# Altium project Ouch_Area.PrjPcb
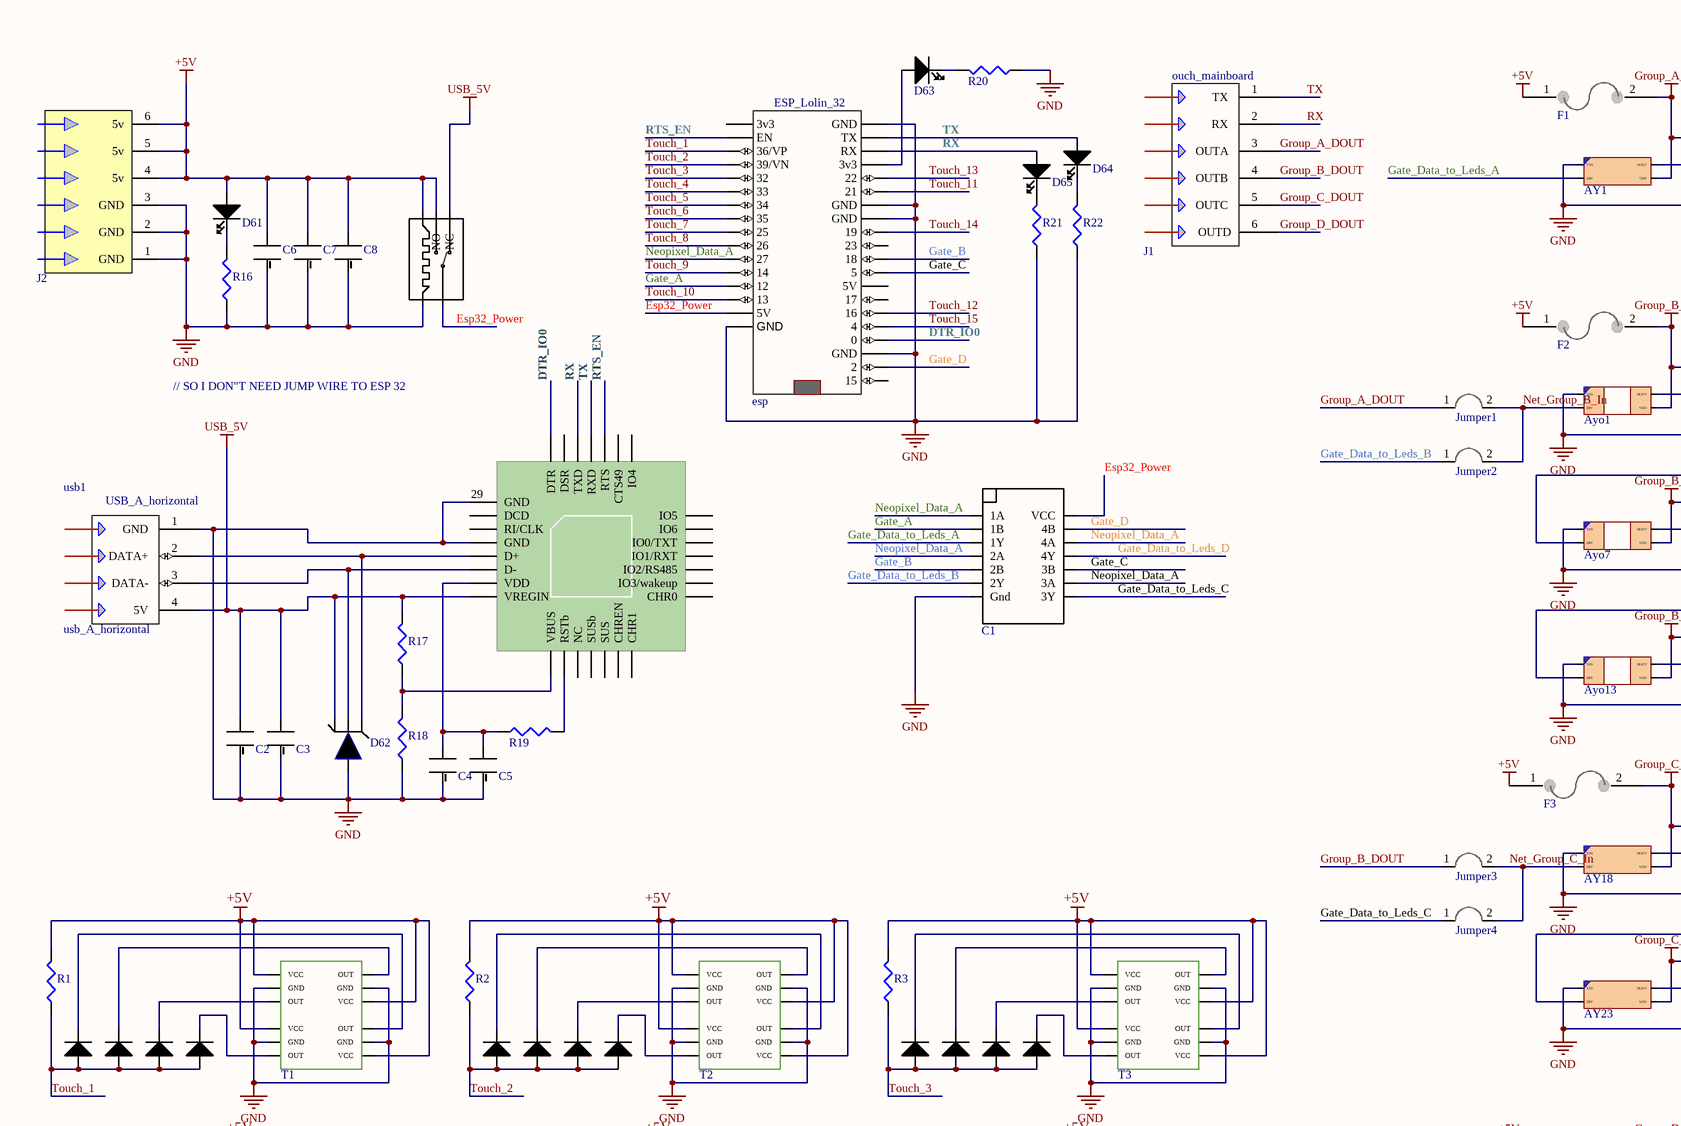
[diagram p0: ouch_area_schematic.SchDoc, top left]
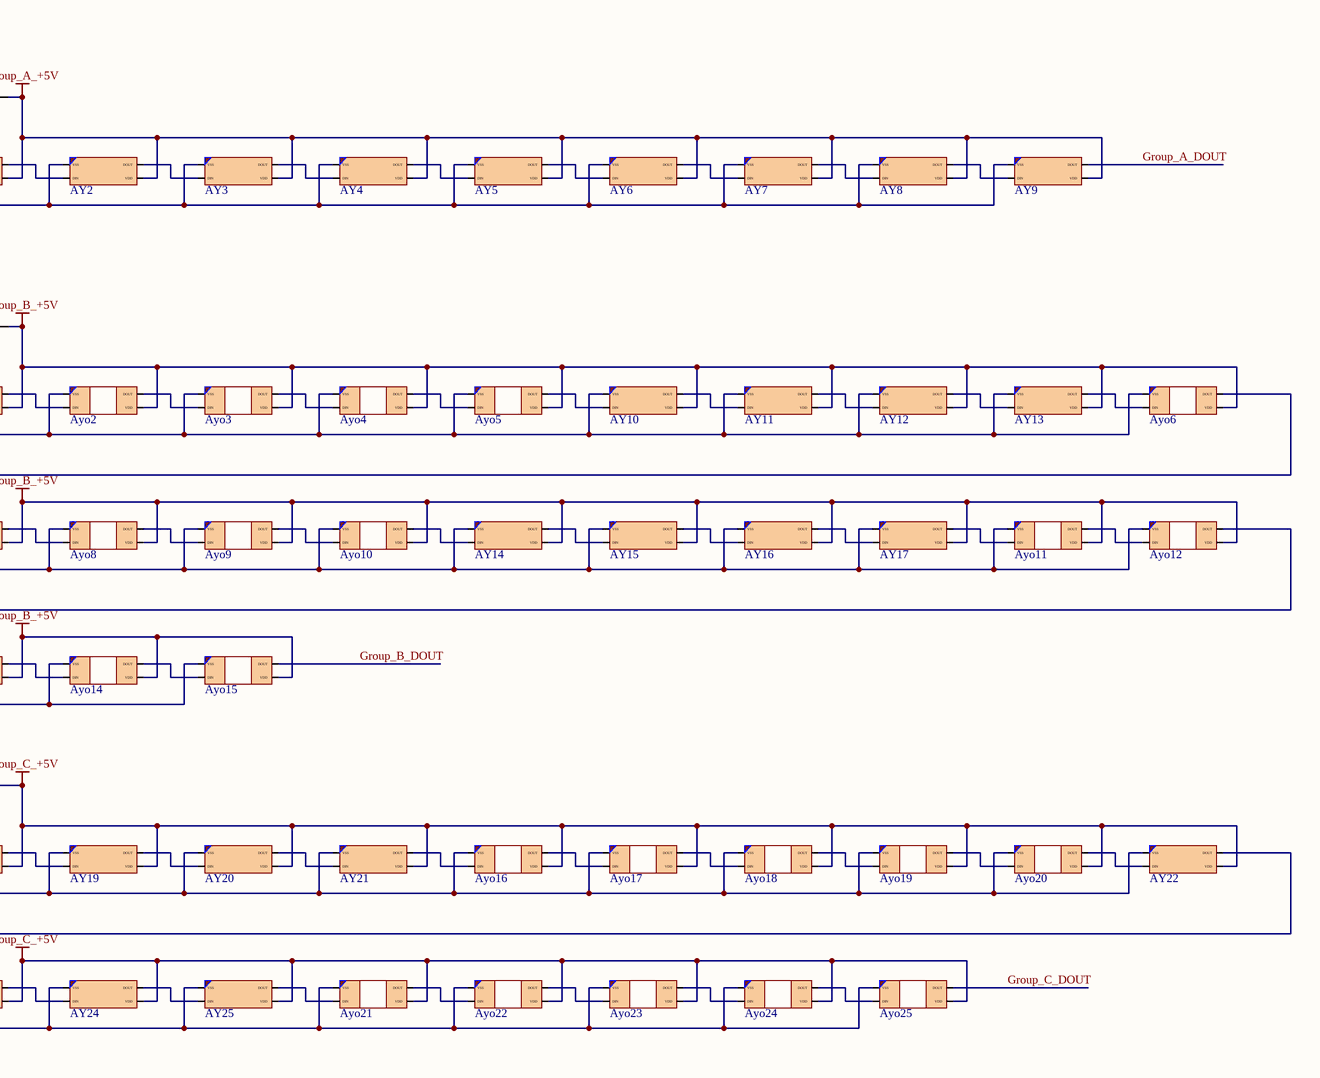
[diagram p1: ouch_area_schematic.SchDoc, top right]
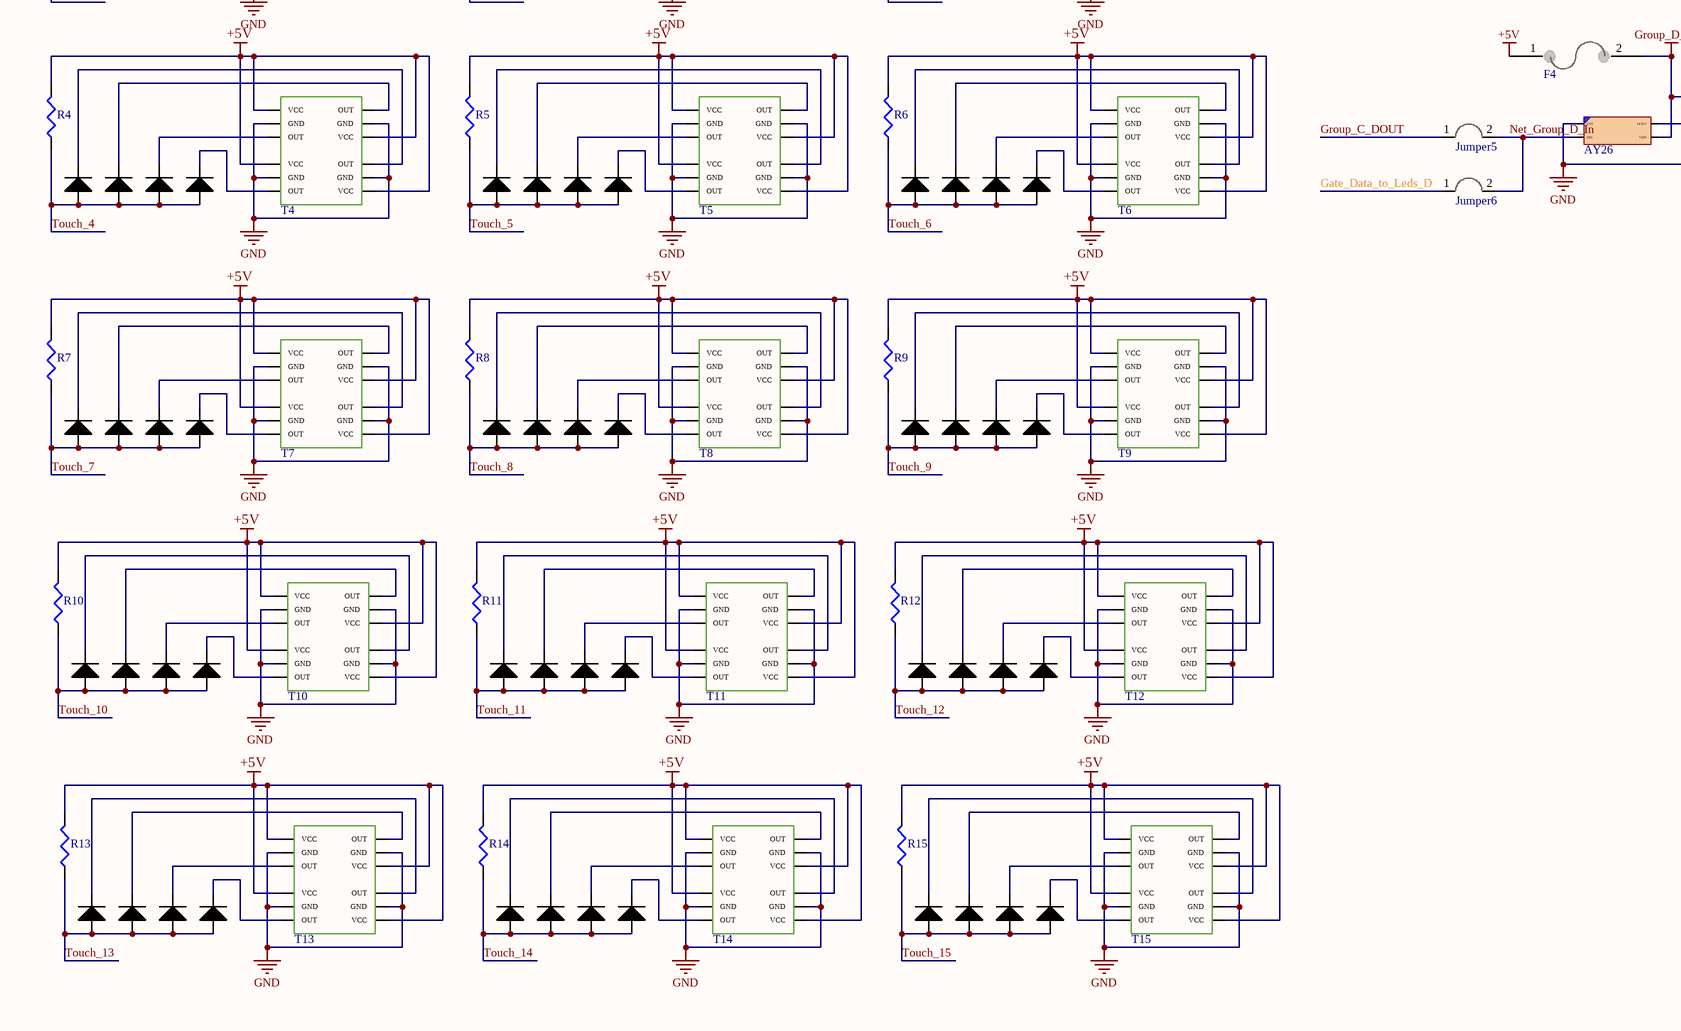
[diagram p2: ouch_area_schematic.SchDoc, bottom left]
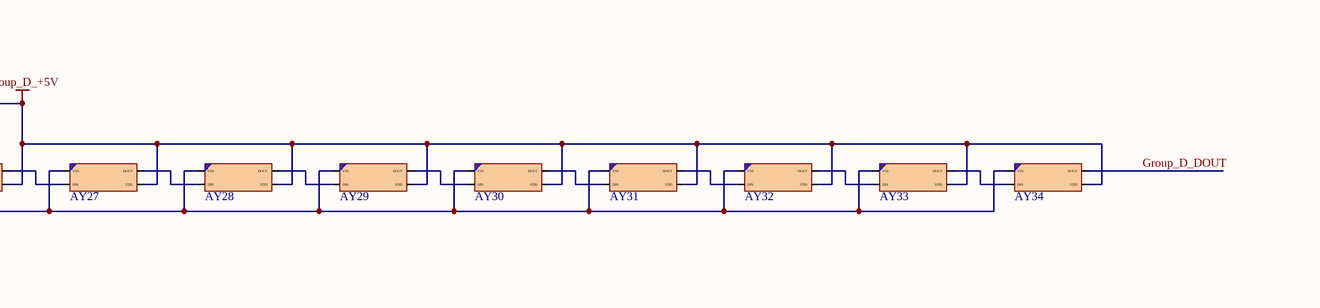
[diagram p3: ouch_area_schematic.SchDoc, bottom right]
1 sheet, 185 parts. Net scope: global (net labels, ports and power ports of the same name join across sheets).
Board file: ouch_area.PcbDoc

## Sheet ouch_area_schematic.SchDoc
size A2; Organization: Altium Limited; Address1: L3, 12a Rodborough Rd; Address2: Frenchs Forest; Address3: NSW; Address4: Australia 2086

### Parts
AY1  1  [27xWs2812B_withC]  (value not drawn)
AY2  28  [27xWs2812B_withC]  (value not drawn)
AY3  55  [27xWs2812B_withC]  (value not drawn)
AY4  82  [27xWs2812B_withC]  (value not drawn)
AY5  109  [27xWs2812B_withC]  (value not drawn)
AY6  136  [27xWs2812B_withC]  (value not drawn)
AY7  163  [27xWs2812B_withC]  (value not drawn)
AY8  190  [27xWs2812B_withC]  (value not drawn)
AY9  217  [27xWs2812B_withC]  (value not drawn)
AY10  304  [27xWs2812B_withC]  (value not drawn)
AY11  331  [27xWs2812B_withC]  (value not drawn)
AY12  358  [27xWs2812B_withC]  (value not drawn)
AY13  385  [27xWs2812B_withC]  (value not drawn)
AY14  472  [27xWs2812B_withC]  (value not drawn)
AY15  499  [27xWs2812B_withC]  (value not drawn)
AY16  526  [27xWs2812B_withC]  (value not drawn)
AY17  553  [27xWs2812B_withC]  (value not drawn)
AY18  640  [27xWs2812B_withC]  (value not drawn)
AY19  667  [27xWs2812B_withC]  (value not drawn)
AY20  694  [27xWs2812B_withC]  (value not drawn)
AY21  721  [27xWs2812B_withC]  (value not drawn)
AY22  808  [27xWs2812B_withC]  (value not drawn)
AY23  835  [27xWs2812B_withC]  (value not drawn)
AY24  862  [27xWs2812B_withC]  (value not drawn)
AY25  889  [27xWs2812B_withC]  (value not drawn)
AY26  976  [27xWs2812B_withC]  (value not drawn)
AY27  1003  [27xWs2812B_withC]  (value not drawn)
AY28  1030  [27xWs2812B_withC]  (value not drawn)
AY29  1057  [27xWs2812B_withC]  (value not drawn)
AY30  1084  [27xWs2812B_withC]  (value not drawn)
AY31  1111  [27xWs2812B_withC]  (value not drawn)
AY32  1138  [27xWs2812B_withC]  (value not drawn)
AY33  1165  [27xWs2812B_withC]  (value not drawn)
AY34  1192  [27xWs2812B_withC]  (value not drawn)
Ayo1  244  [12Xws2812b_owo]  (value not drawn)
Ayo2  256  [12Xws2812b_owo]  (value not drawn)
Ayo3  268  [12Xws2812b_owo]  (value not drawn)
Ayo4  280  [12Xws2812b_owo]  (value not drawn)
Ayo5  292  [12Xws2812b_owo]  (value not drawn)
Ayo6  412  [12Xws2812b_owo]  (value not drawn)
Ayo7  424  [12Xws2812b_owo]  (value not drawn)
Ayo8  436  [12Xws2812b_owo]  (value not drawn)
Ayo9  448  [12Xws2812b_owo]  (value not drawn)
Ayo10  460  [12Xws2812b_owo]  (value not drawn)
Ayo11  580  [12Xws2812b_owo]  (value not drawn)
Ayo12  592  [12Xws2812b_owo]  (value not drawn)
Ayo13  604  [12Xws2812b_owo]  (value not drawn)
Ayo14  616  [12Xws2812b_owo]  (value not drawn)
Ayo15  628  [12Xws2812b_owo]  (value not drawn)
Ayo16  748  [12Xws2812b_owo]  (value not drawn)
Ayo17  760  [12Xws2812b_owo]  (value not drawn)
Ayo18  772  [12Xws2812b_owo]  (value not drawn)
Ayo19  784  [12Xws2812b_owo]  (value not drawn)
Ayo20  796  [12Xws2812b_owo]  (value not drawn)
Ayo21  916  [12Xws2812b_owo]  (value not drawn)
Ayo22  928  [12Xws2812b_owo]  (value not drawn)
Ayo23  940  [12Xws2812b_owo]  (value not drawn)
Ayo24  952  [12Xws2812b_owo]  (value not drawn)
Ayo25  964  [12Xws2812b_owo]  (value not drawn)
C1  74hc08d  [SOP14(74hc08d)]  (value not drawn)
C2  C4R7  [Capacitor0603]  (value not drawn)
C3  C104  [Capacitor0603]  (value not drawn)
C4  C104  [Capacitor0603]  (value not drawn)
C5  C4R7  [Capacitor0603]  (value not drawn)
C6  EEU-FM0J331  [2.5mmCapacitor]  (value not drawn)
C7  EEU-FM0J331  [2.5mmCapacitor]  (value not drawn)
C8  EEU-FM0J331  [2.5mmCapacitor]  (value not drawn)
cp1  CP2102N  [CP2102N_QFN28]  (value not drawn)
D1  LL4148  [SOD80-LL4148]  (value not drawn)
D2  LL4148  [SOD80-LL4148]  (value not drawn)
D3  LL4148  [SOD80-LL4148]  (value not drawn)
D4  LL4148  [SOD80-LL4148]  (value not drawn)
D5  LL4148  [SOD80-LL4148]  (value not drawn)
D6  LL4148  [SOD80-LL4148]  (value not drawn)
D7  LL4148  [SOD80-LL4148]  (value not drawn)
D8  LL4148  [SOD80-LL4148]  (value not drawn)
D9  LL4148  [SOD80-LL4148]  (value not drawn)
D10  LL4148  [SOD80-LL4148]  (value not drawn)
D11  LL4148  [SOD80-LL4148]  (value not drawn)
D12  LL4148  [SOD80-LL4148]  (value not drawn)
D13  LL4148  [SOD80-LL4148]  (value not drawn)
D14  LL4148  [SOD80-LL4148]  (value not drawn)
D15  LL4148  [SOD80-LL4148]  (value not drawn)
D16  LL4148  [SOD80-LL4148]  (value not drawn)
D17  LL4148  [SOD80-LL4148]  (value not drawn)
D18  LL4148  [SOD80-LL4148]  (value not drawn)
D19  LL4148  [SOD80-LL4148]  (value not drawn)
D20  LL4148  [SOD80-LL4148]  (value not drawn)
D21  LL4148  [SOD80-LL4148]  (value not drawn)
D22  LL4148  [SOD80-LL4148]  (value not drawn)
D23  LL4148  [SOD80-LL4148]  (value not drawn)
D24  LL4148  [SOD80-LL4148]  (value not drawn)
D25  LL4148  [SOD80-LL4148]  (value not drawn)
D26  LL4148  [SOD80-LL4148]  (value not drawn)
D27  LL4148  [SOD80-LL4148]  (value not drawn)
D28  LL4148  [SOD80-LL4148]  (value not drawn)
D29  LL4148  [SOD80-LL4148]  (value not drawn)
D30  LL4148  [SOD80-LL4148]  (value not drawn)
D31  LL4148  [SOD80-LL4148]  (value not drawn)
D32  LL4148  [SOD80-LL4148]  (value not drawn)
D33  LL4148  [SOD80-LL4148]  (value not drawn)
D34  LL4148  [SOD80-LL4148]  (value not drawn)
D35  LL4148  [SOD80-LL4148]  (value not drawn)
D36  LL4148  [SOD80-LL4148]  (value not drawn)
D37  LL4148  [SOD80-LL4148]  (value not drawn)
D38  LL4148  [SOD80-LL4148]  (value not drawn)
D39  LL4148  [SOD80-LL4148]  (value not drawn)
D40  LL4148  [SOD80-LL4148]  (value not drawn)
D41  LL4148  [SOD80-LL4148]  (value not drawn)
D42  LL4148  [SOD80-LL4148]  (value not drawn)
D43  LL4148  [SOD80-LL4148]  (value not drawn)
D44  LL4148  [SOD80-LL4148]  (value not drawn)
D45  LL4148  [SOD80-LL4148]  (value not drawn)
D46  LL4148  [SOD80-LL4148]  (value not drawn)
D47  LL4148  [SOD80-LL4148]  (value not drawn)
D48  LL4148  [SOD80-LL4148]  (value not drawn)
D49  LL4148  [SOD80-LL4148]  (value not drawn)
D50  LL4148  [SOD80-LL4148]  (value not drawn)
D51  LL4148  [SOD80-LL4148]  (value not drawn)
D52  LL4148  [SOD80-LL4148]  (value not drawn)
D53  LL4148  [SOD80-LL4148]  (value not drawn)
D54  LL4148  [SOD80-LL4148]  (value not drawn)
D55  LL4148  [SOD80-LL4148]  (value not drawn)
D56  LL4148  [SOD80-LL4148]  (value not drawn)
D57  LL4148  [SOD80-LL4148]  (value not drawn)
D58  LL4148  [SOD80-LL4148]  (value not drawn)
D59  LL4148  [SOD80-LL4148]  (value not drawn)
D60  LL4148  [SOD80-LL4148]  (value not drawn)
D61  P_on  [LED0603]  (value not drawn)
D62  SP0503BAHTG  [SP0503BAHTG - SOT143-4]  (value not drawn)
D63  ESP  [LED0603]  (value not drawn)
D64  TXD  [LED0603]  (value not drawn)
D65  RXD  [LED0603]  (value not drawn)
esp  processor  [ESP_32_socket]  (value not drawn)
F1  PTC_0ZCG0260FF2C  [SMD_1812]  (value not drawn)
F2  PTC_0ZCG0260FF2C  [SMD_1812]  (value not drawn)
F3  PTC_0ZCG0260FF2C  [SMD_1812]  (value not drawn)
F4  PTC_0ZCG0260FF2C  [SMD_1812]  (value not drawn)
J1  ouch_and_mainboard_connector  [xh2.54 6pin]  (value not drawn)
J2  4.2mm_5v_gnd_3x3  [4.2MM_6pin_all_5]  (value not drawn)
Jumper1  FromA  [0805Jumper]  (value not drawn)
Jumper2  NewB  [0805Jumper]  (value not drawn)
Jumper3  FromB  [0805Jumper]  (value not drawn)
Jumper4  NewC  [0805Jumper]  (value not drawn)
Jumper5  FromC  [0805Jumper]  (value not drawn)
Jumper6  NewD  [0805Jumper]  (value not drawn)
R1  R102  [R0805]  (value not drawn)
R2  R102  [R0805]  (value not drawn)
R3  R102  [R0805]  (value not drawn)
R4  R102  [R0805]  (value not drawn)
R5  R102  [R0805]  (value not drawn)
R6  R102  [R0805]  (value not drawn)
R7  R102  [R0805]  (value not drawn)
R8  R102  [R0805]  (value not drawn)
R9  R102  [R0805]  (value not drawn)
R10  R102  [R0805]  (value not drawn)
R11  R102  [R0805]  (value not drawn)
R12  R102  [R0805]  (value not drawn)
R13  R102  [R0805]  (value not drawn)
R14  R102  [R0805]  (value not drawn)
R15  R102  [R0805]  (value not drawn)
R16  R360  [R0805]  (value not drawn)
R17  R2212  [R0805]  (value not drawn)
R18  R4752  [R0805]  (value not drawn)
R19  R102  [R0805]  (value not drawn)
R20  360R  [R0805]  (value not drawn)
R21  R360  [R0805]  (value not drawn)
R22  R360  [R0805]  (value not drawn)
Relay1  Omron_G5v_dc5  [G5v1_5vdc]  (value not drawn)
T1  Touch_pads2x2  [TouchBoard2x2]  (value not drawn)
T2  Touch_pads2x2  [TouchBoard2x2]  (value not drawn)
T3  Touch_pads2x2  [TouchBoard2x2]  (value not drawn)
T4  Touch_pads2x2  [TouchBoard2x2]  (value not drawn)
T5  Touch_pads2x2  [TouchBoard2x2]  (value not drawn)
T6  Touch_pads2x2  [TouchBoard2x2]  (value not drawn)
T7  Touch_pads2x2  [TouchBoard2x2]  (value not drawn)
T8  Touch_pads2x2  [TouchBoard2x2]  (value not drawn)
T9  Touch_pads2x2  [TouchBoard2x2]  (value not drawn)
T10  Touch_pads2x2  [TouchBoard2x2]  (value not drawn)
T11  Touch_pads2x2  [TouchBoard2x2]  (value not drawn)
T12  Touch_pads2x2  [TouchBoard2x2]  (value not drawn)
T13  Touch_pads2x2  [TouchBoard2x2]  (value not drawn)
T14  Touch_pads2x2  [TouchBoard2x2]  (value not drawn)
T15  Touch_pads2x2  [TouchBoard2x2]  (value not drawn)
usb1  usb_A_horizontal  [USBA_male_socket]

### Nets
+5V: C6.2(+) C7.2(+) C8.2(+) D61.2 F1.1 F2.1 F3.1 F4.1 J2.4(5v) J2.5(5v) J2.6(5v) R1.2 R2.2 R3.2 R4.2 R5.2 R6.2 R7.2 R8.2 R9.2 R10.2 R11.2 R12.2 R13.2 R14.2 R15.2 Relay1.1(Coli_A) Relay1.5(NO) T1.1(VCC) T1.4(VCC) T1.7(VCC) T1.10(VCC) T2.1(VCC) T2.4(VCC) T2.7(VCC) T2.10(VCC) T3.1(VCC) T3.4(VCC) T3.7(VCC) T3.10(VCC) T4.1(VCC) T4.4(VCC) T4.7(VCC) T4.10(VCC) T5.1(VCC) T5.4(VCC) T5.7(VCC) T5.10(VCC) T6.1(VCC) T6.4(VCC) T6.7(VCC) T6.10(VCC) T7.1(VCC) T7.4(VCC) T7.7(VCC) T7.10(VCC) T8.1(VCC) T8.4(VCC) T8.7(VCC) T8.10(VCC) T9.1(VCC) T9.4(VCC) T9.7(VCC) T9.10(VCC) T10.1(VCC) T10.4(VCC) T10.7(VCC) T10.10(VCC) T11.1(VCC) T11.4(VCC) T11.7(VCC) T11.10(VCC) T12.1(VCC) T12.4(VCC) T12.7(VCC) T12.10(VCC) T13.1(VCC) T13.4(VCC) T13.7(VCC) T13.10(VCC) T14.1(VCC) T14.4(VCC) T14.7(VCC) T14.10(VCC) T15.1(VCC) T15.4(VCC) T15.7(VCC) T15.10(VCC)
GND: AY1.3(VSS) AY2.3(VSS) AY3.3(VSS) AY4.3(VSS) AY5.3(VSS) AY6.3(VSS) AY7.3(VSS) AY8.3(VSS) AY9.3(VSS) AY10.3(VSS) AY11.3(VSS) AY12.3(VSS) AY13.3(VSS) AY14.3(VSS) AY15.3(VSS) AY16.3(VSS) AY17.3(VSS) AY18.3(VSS) AY19.3(VSS) AY20.3(VSS) AY21.3(VSS) AY22.3(VSS) AY23.3(VSS) AY24.3(VSS) AY25.3(VSS) AY26.3(VSS) AY27.3(VSS) AY28.3(VSS) AY29.3(VSS) AY30.3(VSS) AY31.3(VSS) AY32.3(VSS) AY33.3(VSS) AY34.3(VSS) Ayo1.3(VSS) Ayo2.3(VSS) Ayo3.3(VSS) Ayo4.3(VSS) Ayo5.3(VSS) Ayo6.3(VSS) Ayo7.3(VSS) Ayo8.3(VSS) Ayo9.3(VSS) Ayo10.3(VSS) Ayo11.3(VSS) Ayo12.3(VSS) Ayo13.3(VSS) Ayo14.3(VSS) Ayo15.3(VSS) Ayo16.3(VSS) Ayo17.3(VSS) Ayo18.3(VSS) Ayo19.3(VSS) Ayo20.3(VSS) Ayo21.3(VSS) Ayo22.3(VSS) Ayo23.3(VSS) Ayo24.3(VSS) Ayo25.3(VSS) C1.7(Gnd) C2.1(-) C3.1(-) C4.1(-) C5.1(-) C6.1(-) C7.1(-) C8.1(-) cp1.3(GND) cp1.29(GND) D62.1(+) esp.1(GND) esp.7(GND) esp.8(GND) esp.18(GND) esp.36(GND) J2.1(GND) J2.2(GND) J2.3(GND) R16.1 R18.1 R20.1 R21.1 R22.1 Relay1.2(Coli_B) T1.2(GND) T1.5(GND) T1.8(GND) T1.11(GND) T2.2(GND) T2.5(GND) T2.8(GND) T2.11(GND) T3.2(GND) T3.5(GND) T3.8(GND) T3.11(GND) T4.2(GND) T4.5(GND) T4.8(GND) T4.11(GND) T5.2(GND) T5.5(GND) T5.8(GND) T5.11(GND) T6.2(GND) T6.5(GND) T6.8(GND) T6.11(GND) T7.2(GND) T7.5(GND) T7.8(GND) T7.11(GND) T8.2(GND) T8.5(GND) T8.8(GND) T8.11(GND) T9.2(GND) T9.5(GND) T9.8(GND) T9.11(GND) T10.2(GND) T10.5(GND) T10.8(GND) T10.11(GND) T11.2(GND) T11.5(GND) T11.8(GND) T11.11(GND) T12.2(GND) T12.5(GND) T12.8(GND) T12.11(GND) T13.2(GND) T13.5(GND) T13.8(GND) T13.11(GND) T14.2(GND) T14.5(GND) T14.8(GND) T14.11(GND) T15.2(GND) T15.5(GND) T15.8(GND) T15.11(GND) usb1.1(GND)
Group_A_+5V: AY1.1(VDD) AY2.1(VDD) AY3.1(VDD) AY4.1(VDD) AY5.1(VDD) AY6.1(VDD) AY7.1(VDD) AY8.1(VDD) AY9.1(VDD) F1.2
Group_B_+5V: AY10.1(VDD) AY11.1(VDD) AY12.1(VDD) AY13.1(VDD) AY14.1(VDD) AY15.1(VDD) AY16.1(VDD) AY17.1(VDD) Ayo1.1(VDD) Ayo2.1(VDD) Ayo3.1(VDD) Ayo4.1(VDD) Ayo5.1(VDD) Ayo6.1(VDD) Ayo7.1(VDD) Ayo8.1(VDD) Ayo9.1(VDD) Ayo10.1(VDD) Ayo11.1(VDD) Ayo12.1(VDD) Ayo13.1(VDD) Ayo14.1(VDD) Ayo15.1(VDD) F2.2
Group_C_+5V: AY18.1(VDD) AY19.1(VDD) AY20.1(VDD) AY21.1(VDD) AY22.1(VDD) AY23.1(VDD) AY24.1(VDD) AY25.1(VDD) Ayo16.1(VDD) Ayo17.1(VDD) Ayo18.1(VDD) Ayo19.1(VDD) Ayo20.1(VDD) Ayo21.1(VDD) Ayo22.1(VDD) Ayo23.1(VDD) Ayo24.1(VDD) Ayo25.1(VDD) F3.2
Group_D_+5V: AY26.1(VDD) AY27.1(VDD) AY28.1(VDD) AY29.1(VDD) AY30.1(VDD) AY31.1(VDD) AY32.1(VDD) AY33.1(VDD) AY34.1(VDD) F4.2
USB_5V: C2.2(+) C3.2(+) cp1.7(VREGIN) D62.4 R17.2 Relay1.4(NC) usb1.4(5V)
DTR_IO0: cp1.28(DTR) esp.17(0)
Esp32_Power: C1.14(VCC) esp.35(5V) Relay1.3(COM)
Gate_A: C1.2(1B) esp.33(12)
Gate_B: C1.5(2B) esp.11(18)
Gate_C: C1.10(3B) esp.12(5)
Gate_D: C1.13(4B) esp.19(2)
Gate_Data_to_Leds_A: AY1.4(DIN) C1.3(1Y)
Gate_Data_to_Leds_B: C1.6(2Y) Jumper2.1
Gate_Data_to_Leds_C: C1.8(3Y) Jumper4.1
Gate_Data_to_Leds_D: C1.11(4Y) Jumper6.1
Group_A_DOUT: AY9.2(DOUT) J1.3(OUTA) Jumper1.1
Group_B_DOUT: Ayo15.2(DOUT) J1.4(OUTB) Jumper3.1
Group_C_DOUT: Ayo25.2(DOUT) J1.5(OUTC) Jumper5.1
Group_D_DOUT: AY34.2(DOUT) J1.6(OUTD)
Neopixel_Data_A: C1.1(1A) C1.4(2A) C1.9(3A) C1.12(4A) esp.31(27)
Net_Group_B_In: Ayo1.4(DIN) Jumper1.2 Jumper2.2
Net_Group_C_In: AY18.4(DIN) Jumper3.2 Jumper4.2
Net_Group_D_In: AY26.4(DIN) Jumper5.2 Jumper6.2
RTS_EN: cp1.24(RTS) esp.22(EN)
RX: cp1.26(TXD) D65.2 esp.3(RX) J1.2(RX)
Touch_1: D1.2 D2.2 D3.2 D4.2 esp.23(36/VP) R1.1
Touch_2: D5.2 D6.2 D7.2 D8.2 esp.24(39/VN) R2.1
Touch_3: D9.2 D10.2 D11.2 D12.2 esp.25(32) R3.1
Touch_4: D13.2 D14.2 D15.2 D16.2 esp.26(33) R4.1
Touch_5: D17.2 D18.2 D19.2 D20.2 esp.27(34) R5.1
Touch_6: D21.2 D22.2 D23.2 D24.2 esp.28(35) R6.1
Touch_7: D25.2 D26.2 D27.2 D28.2 esp.29(25) R7.1
Touch_8: D29.2 D30.2 D31.2 D32.2 esp.30(26) R8.1
Touch_9: D33.2 D34.2 D35.2 D36.2 esp.32(14) R9.1
Touch_10: D37.2 D38.2 D39.2 D40.2 esp.34(13) R10.1
Touch_11: D41.2 D42.2 D43.2 D44.2 esp.6(21) R11.1
Touch_12: D45.2 D46.2 D47.2 D48.2 esp.15(16) R12.1
Touch_13: D49.2 D50.2 D51.2 D52.2 esp.5(22) R13.1
Touch_14: D53.2 D54.2 D55.2 D56.2 esp.9(19) R14.1
Touch_15: D57.2 D58.2 D59.2 D60.2 esp.16(4) R15.1
TX: cp1.25(RXD) D64.2 esp.2(TX) J1.1(TX)
NetAY1_2: AY1.2(DOUT) AY2.4(DIN)
NetAY2_2: AY2.2(DOUT) AY3.4(DIN)
NetAY3_2: AY3.2(DOUT) AY4.4(DIN)
NetAY4_2: AY4.2(DOUT) AY5.4(DIN)
NetAY5_2: AY5.2(DOUT) AY6.4(DIN)
NetAY6_2: AY6.2(DOUT) AY7.4(DIN)
NetAY7_2: AY7.2(DOUT) AY8.4(DIN)
NetAY8_2: AY8.2(DOUT) AY9.4(DIN)
NetAY10_2: AY10.2(DOUT) AY11.4(DIN)
NetAY10_4: AY10.4(DIN) Ayo5.2(DOUT)
NetAY11_2: AY11.2(DOUT) AY12.4(DIN)
NetAY12_2: AY12.2(DOUT) AY13.4(DIN)
NetAY13_2: AY13.2(DOUT) Ayo6.4(DIN)
NetAY14_2: AY14.2(DOUT) AY15.4(DIN)
NetAY14_4: AY14.4(DIN) Ayo10.2(DOUT)
NetAY15_2: AY15.2(DOUT) AY16.4(DIN)
NetAY16_2: AY16.2(DOUT) AY17.4(DIN)
NetAY17_2: AY17.2(DOUT) Ayo11.4(DIN)
NetAY18_2: AY18.2(DOUT) AY19.4(DIN)
NetAY19_2: AY19.2(DOUT) AY20.4(DIN)
NetAY20_2: AY20.2(DOUT) AY21.4(DIN)
NetAY21_2: AY21.2(DOUT) Ayo16.4(DIN)
NetAY22_2: AY22.2(DOUT) AY23.4(DIN)
NetAY22_4: AY22.4(DIN) Ayo20.2(DOUT)
NetAY23_2: AY23.2(DOUT) AY24.4(DIN)
NetAY24_2: AY24.2(DOUT) AY25.4(DIN)
NetAY25_2: AY25.2(DOUT) Ayo21.4(DIN)
NetAY26_2: AY26.2(DOUT) AY27.4(DIN)
NetAY27_2: AY27.2(DOUT) AY28.4(DIN)
NetAY28_2: AY28.2(DOUT) AY29.4(DIN)
NetAY29_2: AY29.2(DOUT) AY30.4(DIN)
NetAY30_2: AY30.2(DOUT) AY31.4(DIN)
NetAY31_2: AY31.2(DOUT) AY32.4(DIN)
NetAY32_2: AY32.2(DOUT) AY33.4(DIN)
NetAY33_2: AY33.2(DOUT) AY34.4(DIN)
NetAyo1_2: Ayo1.2(DOUT) Ayo2.4(DIN)
NetAyo2_2: Ayo2.2(DOUT) Ayo3.4(DIN)
NetAyo3_2: Ayo3.2(DOUT) Ayo4.4(DIN)
NetAyo4_2: Ayo4.2(DOUT) Ayo5.4(DIN)
NetAyo6_2: Ayo6.2(DOUT) Ayo7.4(DIN)
NetAyo7_2: Ayo7.2(DOUT) Ayo8.4(DIN)
NetAyo8_2: Ayo8.2(DOUT) Ayo9.4(DIN)
NetAyo9_2: Ayo9.2(DOUT) Ayo10.4(DIN)
NetAyo11_2: Ayo11.2(DOUT) Ayo12.4(DIN)
NetAyo12_2: Ayo12.2(DOUT) Ayo13.4(DIN)
NetAyo13_2: Ayo13.2(DOUT) Ayo14.4(DIN)
NetAyo14_2: Ayo14.2(DOUT) Ayo15.4(DIN)
NetAyo16_2: Ayo16.2(DOUT) Ayo17.4(DIN)
NetAyo17_2: Ayo17.2(DOUT) Ayo18.4(DIN)
NetAyo18_2: Ayo18.2(DOUT) Ayo19.4(DIN)
NetAyo19_2: Ayo19.2(DOUT) Ayo20.4(DIN)
NetAyo21_2: Ayo21.2(DOUT) Ayo22.4(DIN)
NetAyo22_2: Ayo22.2(DOUT) Ayo23.4(DIN)
NetAyo23_2: Ayo23.2(DOUT) Ayo24.4(DIN)
NetAyo24_2: Ayo24.2(DOUT) Ayo25.4(DIN)
NetC4_2: C4.2(+) C5.2(+) cp1.6(VDD) R19.1
Netcp1_4: cp1.4(D+) D62.2 usb1.2(DATA+)
Netcp1_5: cp1.5(D-) D62.3 usb1.3(DATA-)
Netcp1_8: cp1.8(VBUS) R17.1 R18.2
Netcp1_9: cp1.9(RSTb) R19.2
NetD1_1: D1.1 T1.9(OUT)
NetD2_1: D2.1 T1.12(OUT)
NetD3_1: D3.1 T1.3(OUT)
NetD4_1: D4.1 T1.6(OUT)
NetD5_1: D5.1 T2.9(OUT)
NetD6_1: D6.1 T2.12(OUT)
NetD7_1: D7.1 T2.3(OUT)
NetD8_1: D8.1 T2.6(OUT)
NetD9_1: D9.1 T3.9(OUT)
NetD10_1: D10.1 T3.12(OUT)
NetD11_1: D11.1 T3.3(OUT)
NetD12_1: D12.1 T3.6(OUT)
NetD13_1: D13.1 T4.9(OUT)
NetD14_1: D14.1 T4.12(OUT)
NetD15_1: D15.1 T4.3(OUT)
NetD16_1: D16.1 T4.6(OUT)
NetD17_1: D17.1 T5.9(OUT)
NetD18_1: D18.1 T5.12(OUT)
NetD19_1: D19.1 T5.3(OUT)
NetD20_1: D20.1 T5.6(OUT)
NetD21_1: D21.1 T6.9(OUT)
NetD22_1: D22.1 T6.12(OUT)
NetD23_1: D23.1 T6.3(OUT)
NetD24_1: D24.1 T6.6(OUT)
NetD25_1: D25.1 T7.9(OUT)
NetD26_1: D26.1 T7.12(OUT)
NetD27_1: D27.1 T7.3(OUT)
NetD28_1: D28.1 T7.6(OUT)
NetD29_1: D29.1 T8.9(OUT)
NetD30_1: D30.1 T8.12(OUT)
NetD31_1: D31.1 T8.3(OUT)
NetD32_1: D32.1 T8.6(OUT)
NetD33_1: D33.1 T9.9(OUT)
NetD34_1: D34.1 T9.12(OUT)
NetD35_1: D35.1 T9.3(OUT)
NetD36_1: D36.1 T9.6(OUT)
NetD37_1: D37.1 T10.9(OUT)
NetD38_1: D38.1 T10.12(OUT)
NetD39_1: D39.1 T10.3(OUT)
NetD40_1: D40.1 T10.6(OUT)
NetD41_1: D41.1 T11.9(OUT)
NetD42_1: D42.1 T11.12(OUT)
NetD43_1: D43.1 T11.3(OUT)
NetD44_1: D44.1 T11.6(OUT)
NetD45_1: D45.1 T12.9(OUT)
NetD46_1: D46.1 T12.12(OUT)
NetD47_1: D47.1 T12.3(OUT)
NetD48_1: D48.1 T12.6(OUT)
NetD49_1: D49.1 T13.9(OUT)
NetD50_1: D50.1 T13.12(OUT)
NetD51_1: D51.1 T13.3(OUT)
NetD52_1: D52.1 T13.6(OUT)
NetD53_1: D53.1 T14.9(OUT)
NetD54_1: D54.1 T14.12(OUT)
NetD55_1: D55.1 T14.3(OUT)
NetD56_1: D56.1 T14.6(OUT)
NetD57_1: D57.1 T15.9(OUT)
NetD58_1: D58.1 T15.12(OUT)
NetD59_1: D59.1 T15.3(OUT)
NetD60_1: D60.1 T15.6(OUT)
NetD61_1: D61.1 R16.2
NetD63_1: D63.1 R20.2
NetD63_2: D63.2 esp.4(3v3)
NetD64_1: D64.1 R22.2
NetD65_1: D65.1 R21.2

Not connected (* = marked no-connect by the designer): cp1 1(DCD) 2(RI/CLK) 10(NC) 11(SUSb) 12(SUS) 13(CHREN) 14(CHR1) 15(CHR0) 16(IO3/wakeup) 17(IO2/RS485) 18(IO1/RXT) 19(IO0/TXT) 20(IO6) 21(IO5) 22(IO4) 23(CTS49) 27(DSR); esp 10(23) 13(5V) 14(17) 20(15) 21(3v3)

### Notes on the sheet
- // SO I DON"T NEED JUMP WIRE TO ESP 32
- Title
- Size:
- Date:
- File:
- A2
- Number:
- Time:
- Revision:
- Sheet
- of
- (in symbol ESP_32_lolin) ESP_Lolin_32
- (in symbol ouch_and_mainboard_connector) ouch_mainboard
- (in symbol usb_A_horizontal) USB_A_horizontal

### Library data of the parts
AY1-AY34 = Ws2812_27leds
Ayo1-Ayo25 = Ws2812_12ledsOwO
C1 = 74HC08: ComponentLink1Description: 4 2-input and gate; ComponentLink1URL: https://pdf1.alldatasheet.com/datasheet-pdf/view/646498/PHILIPS/74HC08D.html
C2 = capacitor0603: Cap Ceramic 4.7uF 6.3V X5R 20% Pad SMD 0402 85C T/R; Manufacturer 1: Murata; Manufacturer Part Number 1: GRM155R60J475ME87J; Supplier 1: Digi-Key; RoHS: No; Category: Ceramic Capacitors; Stock 1: 206568; Pricing 1: 1=0.16000, 10=0.11100, 50=0.06280, 100=0.05210, 500=0.03654, 1000=0.03025, 2500=0.02815, 5000=0.02575 (USD); Capacitance: 4.7uF; Tolerance: 20%; Dielectric: X5R; Voltage Rating (DC): 6.3V; Length: 1mm; Thickness: 500um; Width: 500um; ComponentLink1URL: https://search.murata.co.jp/Ceramy/image/img/A01X/G101/ENG/GRM155R60J475ME87-01.pdf?src-supplier=Digi-Key; ComponentLink1Description: https://search.murata.co.jp/Ceramy/image/img/A01X/G101/ENG/GRM155R60J475ME87-01.pdf?src-supplier=Digi-Key; Supplier Part Number 1: 490-18211-1-ND
C3 = capacitor0603: 0.1uf; Manufacturer 1: Murata; Manufacturer Part Number 1: GRM155R60J475ME87J; Capacitance: 4.7uF; Tolerance: 20%; Dielectric: X5R; Voltage Rating (DC): 6.3V; Supplier 1: Digi-Key; RoHS: No; Category: Ceramic Capacitors; Stock 1: 206568; Pricing 1: 1=0.16000, 10=0.11100, 50=0.06280, 100=0.05210, 500=0.03654, 1000=0.03025, 2500=0.02815, 5000=0.02575 (USD); Length: 1mm; Thickness: 500um; Width: 500um; ComponentLink1URL: https://search.murata.co.jp/Ceramy/image/img/A01X/G101/ENG/GRM155R60J475ME87-01.pdf?src-supplier=Digi-Key; ComponentLink1Description: https://search.murata.co.jp/Ceramy/image/img/A01X/G101/ENG/GRM155R60J475ME87-01.pdf?src-supplier=Digi-Key; Supplier Part Number 1: 490-18211-1-ND
C4 = capacitor0603: 4.7; Manufacturer 1: Murata; Manufacturer Part Number 1: GRM155R60J475ME87J; Capacitance: 4.7uF; Tolerance: 20%; Dielectric: X5R; Voltage Rating (DC): 6.3V; Supplier 1: Digi-Key; RoHS: No; Category: Ceramic Capacitors; Stock 1: 206568; Pricing 1: 1=0.16000, 10=0.11100, 50=0.06280, 100=0.05210, 500=0.03654, 1000=0.03025, 2500=0.02815, 5000=0.02575 (USD); Length: 1mm; Thickness: 500um; Width: 500um; ComponentLink1URL: https://search.murata.co.jp/Ceramy/image/img/A01X/G101/ENG/GRM155R60J475ME87-01.pdf?src-supplier=Digi-Key; ComponentLink1Description: https://search.murata.co.jp/Ceramy/image/img/A01X/G101/ENG/GRM155R60J475ME87-01.pdf?src-supplier=Digi-Key; Supplier Part Number 1: 490-18211-1-ND
C5 = capacitor0603: 0.1; Manufacturer 1: Murata; Manufacturer Part Number 1: GRM155R60J475ME87J; Capacitance: 4.7uF; Tolerance: 20%; Dielectric: X5R; Voltage Rating (DC): 6.3V; Supplier 1: Digi-Key; RoHS: No; Category: Ceramic Capacitors; Stock 1: 206568; Pricing 1: 1=0.16000, 10=0.11100, 50=0.06280, 100=0.05210, 500=0.03654, 1000=0.03025, 2500=0.02815, 5000=0.02575 (USD); Length: 1mm; Thickness: 500um; Width: 500um; ComponentLink1URL: https://search.murata.co.jp/Ceramy/image/img/A01X/G101/ENG/GRM155R60J475ME87-01.pdf?src-supplier=Digi-Key; ComponentLink1Description: https://search.murata.co.jp/Ceramy/image/img/A01X/G101/ENG/GRM155R60J475ME87-01.pdf?src-supplier=Digi-Key; Supplier Part Number 1: 490-18211-1-ND
C6-C8 = EEU-FM0J331: Cap 330 uF;  Tol 20%;  Vol-Rtg 6.3 VDC;  Radial;  6.3x11.2;  Bulk; Manufacturer 1: Panasonic; Dielectric Material: Aluminium; Ripple Current (AC): 455mA; Capacitance: 330uF; Voltage Rating: 6.3V; Impedance: 130mR; Life (Hours): 2000Hour; Leakage Current: 10nA; Lead Length: 17mm; Lead Diameter: 0.5mm; Outside Diameter: 6mm; Supplier 1: Digi-Key; Manufacturer Part Number 1: EEU-FM0J331; RoHS: Yes; Category: Aluminum Electrolytic Capacitors; Stock 1: 15455; Pricing 1: 1=0.30000, 10=0.21200, 50=0.14800, 100=0.12690, 500=0.09518, 1000=0.08037, 2500=0.07614, 5000=0.07191 (USD); Mount: Through Hole,PCB; Case/Package: Radial; Number of Pins: 2; Min Operating Temperature: -40°C; Max Operating Temperature: 105°C; Packaging: Bulk; Tolerance: 20%; Ripple Current: 455mA; Package Quantity: 200; ESR (Equivalent Series Resistance): 130mR; Voltage Rating (DC): 6.3V; Termination: Radial; Voltage: 6.3V; Diameter: 6mm; Length: 11.2mm; Height: 11.2mm; Lead Pitch: 2.5mm; Height - Seated (Max): 0.5inch; Radiation Hardening: No; Lead Free: Lead Free; REACH SVHC: No SVHC; ComponentLink1URL: https://datasheet.ciiva.com/11778/0900766b805f3abe-11778876.pdf?src-supplier=RSComponents; ComponentLink1Description: https://datasheet.ciiva.com/11778/0900766b805f3abe-11778876.pdf?src-supplier=RSComponents; ComponentLink2URL: https://datasheet.ciiva.com/92/aba0000ce108-92408.pdf?src-supplier=Digi-Key; ComponentLink2Description: https://datasheet.ciiva.com/92/aba0000ce108-92408.pdf?src-supplier=Digi-Key; ComponentLink3URL: https://datasheet.ciiva.com/30086/aba0000ce108-30086253.pdf?src-supplier=Onlinecomponents.com; ComponentLink3Description: https://datasheet.ciiva.com/30086/aba0000ce108-30086253.pdf?src-supplier=Onlinecomponents.com; ComponentLink4URL: https://datasheet.ciiva.com/16432/aba0000ce108-16432949.pdf?src-supplier=Future+Electronics; ComponentLink4Description: https://datasheet.ciiva.com/16432/aba0000ce108-16432949.pdf?src-supplier=Future+Electronics; ComponentLink5URL: https://datasheet.ciiva.com/46441/26036-46441017.pdf?src-supplier=Element14; ComponentLink5Description: https://datasheet.ciiva.com/46441/26036-46441017.pdf?src-supplier=Element14; ComponentLink6URL: https://datasheet.ciiva.com/14608/70068540-14608622.pdf?src-supplier=Allied+Electronics; ComponentLink6Description: https://datasheet.ciiva.com/14608/70068540-14608622.pdf?src-supplier=Allied+Electronics; Supplier Part Number 1: P12918-ND
cp1 = CP2102N-A02-GQFN28R: Full Speed USB to UART Bridge USB 2.0 3.3V T/R Automotive 28-Pin QFN EP; Manufacturer 1: Silicon Labs; Supplier 1: Digi-Key; Manufacturer Part Number 1: CP2102N-A02-GQFN28R; RoHS: No; Stock 1: 1682; Pricing 1: 1=1.40000, 25=1.35160, 100=1.29950 (USD); Supplier Part Number 1: 336-5890-1-ND
D1-D60 = LL4148: ON SEMICONDUCTOR - LL4148 - Small Signal Diode, Single, 100 V, 200 mA, 1 V, 4 ns, 2 A; Manufacturer 1: ON Semiconductor / Fairchild; Average Rectified Current: 200mA; Max Repetitive Reverse Voltage (Vrrm): 100V; Max Surge Current: 2A; Forward Voltage: 1V; Max Reverse Current: 25nA; Recovery Time: 4ns; Power Dissipation: 500mW; Supplier 1: Digi-Key; Manufacturer Part Number 1: LL4148; RoHS: Yes; Category: Rectifier Diodes; Stock 1: 428902; Pricing 1: 1=0.10000, 10=0.08400, 100=0.03220, 500=0.02346, 1000=0.01575 (USD); Mount: Surface Mount; Number of Pins: 2; Weight: 0.01lb; Contact Plating: Tin,Matte; Min Operating Temperature: -65°C; Max Operating Temperature: 175°C; Packaging: Tape and Reel; Package Quantity: 2500; Forward Current: 200mA; Reverse Recovery Time: 4ns; Peak Non-Repetitive Surge Current: 2A; Max Forward Surge Current (Ifsm): 2A; Element Configuration: Single; Voltage: 100V; Max Reverse Voltage (DC): 100V; Reverse Voltage: 100V; Length: 3.6mm; Width: 1.5mm; Height: 1.5mm; Radiation Hardening: No; REACH SVHC: No SVHC; Lead Free: Lead Free; ComponentLink1URL: https://datasheet.ciiva.com/1181/1730036-1181026.pdf?src-supplier=Element14; ComponentLink1Description: https://datasheet.ciiva.com/1181/1730036-1181026.pdf?src-supplier=Element14; ComponentLink2URL: https://datasheet.ciiva.com/8303/ll4148-8303779.pdf?src-supplier=Avnet; ComponentLink2Description: https://datasheet.ciiva.com/8303/ll4148-8303779.pdf?src-supplier=Avnet; ComponentLink3URL: https://datasheet.ciiva.com/27048/94908-27048041.pdf?src-supplier=Jameco; ComponentLink3Description: https://datasheet.ciiva.com/27048/94908-27048041.pdf?src-supplier=Jameco; ComponentLink4URL: https://datasheet.ciiva.com/4453/ll4148-70504-4453114.pdf?src-supplier=Mouser; ComponentLink4Description: https://datasheet.ciiva.com/4453/ll4148-70504-4453114.pdf?src-supplier=Mouser; ComponentLink5URL: https://datasheet.ciiva.com/910/ll4148-910343.pdf?src-supplier=Digi-Key; ComponentLink5Description: https://datasheet.ciiva.com/910/ll4148-910343.pdf?src-supplier=Digi-Key; ComponentLink6URL: https://datasheet.ciiva.com/910/ll4148-910344.pdf?src-supplier=Digi-Key; ComponentLink6Description: https://datasheet.ciiva.com/910/ll4148-910344.pdf?src-supplier=Digi-Key; ComponentLink7URL: https://datasheet.ciiva.com/910/ll4148-910345.pdf?src-supplier=Digi-Key; ComponentLink7Description: https://datasheet.ciiva.com/910/ll4148-910345.pdf?src-supplier=Digi-Key; ComponentLink8URL: https://datasheet.ciiva.com/22735/1896420-22735578.pdf?src-supplier=Element14; ComponentLink8Description: https://datasheet.ciiva.com/22735/1896420-22735578.pdf?src-supplier=Element14; ComponentLink9URL: https://datasheet.ciiva.com/26912/getdatasheetpartid-110057-26912779.pdf?src-supplier=Verical; ComponentLink9Description: https://datasheet.ciiva.com/26912/getdatasheetpartid-110057-26912779.pdf?src-supplier=Verical; ComponentLink10URL: https://datasheet.ciiva.com/8053/1896420-8053645.pdf?src-supplier=Element14; ComponentLink10Description: https://datasheet.ciiva.com/8053/1896420-8053645.pdf?src-supplier=Element14; Supplier Part Number 1: LL4148FSCT-ND
D61 D63-D65 = LTST-C190TBKT: LED BLUE CLEAR CHIP SMD; Manufacturer 1: Vishay Lite-On; Lens Color: Colorless; Viewing Angle: 130°; Forward Voltage: 3.8V; Lens Style: Diffused,Colorless,Clear,Rectangular; Luminous Intensity: 180mcd; Forward Current: 20mA; Dominant Wavelength: 475nm; Number of Elements: 1; Power Dissipation: 76mW; Wavelength: 468nm; Reverse Voltage: 5V; Supplier 1: Digi-Key; Manufacturer Part Number 1: LTST-C190TBKT; RoHS: Yes; Category: LEDs; Stock 1: 76203; Pricing 1: 1=0.50000, 10=0.35600, 100=0.15840, 500=0.11088, 1000=0.09108 (USD); Mount: Surface Mount; Case/Package: 0603; Number of Pins: 2; Color: Blue; Case Code (Metric): 1608; Case Code (Imperial): 0603; Min Operating Temperature: -20°C; Max Operating Temperature: 80°C; Packaging: Tape and Reel; Package Quantity: 1; Illumination Color: Blue; Test Current: 20mA; Lens Transparency: Clear; Number of LEDs: 1; Length: 1.6mm; Height: 0.8mm; Width: 0.8mm; Depth: 0.8mm; Radiation Hardening: No; Lead Free: Lead Free; ComponentLink1URL: https://datasheet.ciiva.com/16353/lite-on20ltst-c190tbkt-16353409.pdf?src-supplier=Future+Electronics; ComponentLink1Description: https://datasheet.ciiva.com/16353/lite-on20ltst-c190tbkt-16353409.pdf?src-supplier=Future+Electronics; ComponentLink2URL: https://datasheet.ciiva.com/15117/getdatasheetpartid-131310-15117667.pdf?src-supplier=Verical; ComponentLink2Description: https://datasheet.ciiva.com/15117/getdatasheetpartid-131310-15117667.pdf?src-supplier=Verical; ComponentLink3URL: https://datasheet.ciiva.com/2110/ltst-c190tbkt-2110473.pdf?src-supplier=Digi-Key; ComponentLink3Description: https://datasheet.ciiva.com/2110/ltst-c190tbkt-2110473.pdf?src-supplier=Digi-Key; ComponentLink4URL: https://datasheet.ciiva.com/12400/lite-on-ltst-c190tbkt-187381-12400873.pdf?src-supplier=Mouser; ComponentLink4Description: https://datasheet.ciiva.com/12400/lite-on-ltst-c190tbkt-187381-12400873.pdf?src-supplier=Mouser; ComponentLink5URL: https://datasheet.ciiva.com/11774/0900766b80dc02ab-11774378.pdf?src-supplier=RSComponents; ComponentLink5Description: https://datasheet.ciiva.com/11774/0900766b80dc02ab-11774378.pdf?src-supplier=RSComponents; ComponentLink6URL: https://datasheet.ciiva.com/26913/ltst-c190tbkt-26913716.pdf?src-supplier=IIIC; ComponentLink6Description: https://datasheet.ciiva.com/26913/ltst-c190tbkt-26913716.pdf?src-supplier=IIIC; ComponentLink7URL: https://datasheet.ciiva.com/2110/s-110-ltst-c190tbkt0630-2110475.pdf?src-supplier=Digi-Key; ComponentLink7Description: https://datasheet.ciiva.com/2110/s-110-ltst-c190tbkt0630-2110475.pdf?src-supplier=Digi-Key; ComponentLink8Description: 橘色的; ComponentLink8URL: https://www.digikey.tw/product-detail/zh/lite-on-inc/LTST-C191KFKT/160-1445-1-ND/386832
D62 = SP0503BAHTG: ESD Suppressor TVS 5.5V 4-Pin(3+Tab) SOT-143 T/R; Manufacturer 1: Littelfuse; Element Configuration: Common Anode; Direction: Unidirectional; Capacitance: 30pF; Number of Channels: 3; Clamping Voltage: 8.5V; Power Line Protection: No; Polarity: Bidirectional,Unidirectional; Max Power Dissipation: 225mW; ESD Protection: Yes; Max Reverse Leakage Current: 100nA; Voltage Rating (DC): 5V; Diode Type: Avalanche; Supplier 1: Digi-Key; Manufacturer Part Number 1: SP0503BAHTG; RoHS: Yes; Category: Diodes; Stock 1: 63906; Pricing 1: 1=0.80000, 10=0.66000, 100=0.51120, 500=0.38340, 1000=0.30885 (USD); Mount: Surface Mount; Case/Package: SOT-143; Number of Pins: 4; Min Operating Temperature: -40°C; Max Operating Temperature: 85°C; Operating Supply Voltage: 5.5V; Packaging: Tape and Reel; Number of Unidirectional Channels: 3; Reverse Standoff Voltage: 5.5V; Breakdown Voltage: 5.5V; Termination: SMD/SMT; Working Voltage: 5.5V; Peak Pulse Power: 225mW; Leakage Current: 100nA; Number of Elements: 3; Power Dissipation: 225mW; Resistor Type: Zener; Length: 3.04mm; Height: 1.05mm; Width: 1.4mm; Depth: 1.4mm; Radiation Hardening: No; REACH SVHC: No SVHC; Lead Free: Lead Free; ComponentLink1URL: https://datasheet.ciiva.com/15143/getdatasheetpartid-116020-15143550.pdf?src-supplier=Verical; ComponentLink1Description: https://datasheet.ciiva.com/15143/getdatasheetpartid-116020-15143550.pdf?src-supplier=Verical; ComponentLink2URL: https://datasheet.ciiva.com/332/sp05xxba-332550.pdf?src-supplier=Digi-Key; ComponentLink2Description: https://datasheet.ciiva.com/332/sp05xxba-332550.pdf?src-supplier=Digi-Key; ComponentLink3URL: https://datasheet.ciiva.com/8062/littefuse-spa-sp050x-8062422.pdf?src-supplier=Element14; ComponentLink3Description: https://datasheet.ciiva.com/8062/littefuse-spa-sp050x-8062422.pdf?src-supplier=Element14; ComponentLink4URL: https://datasheet.ciiva.com/22697/1911798-22697942.pdf?src-supplier=Element14; ComponentLink4Description: https://datasheet.ciiva.com/22697/1911798-22697942.pdf?src-supplier=Element14; ComponentLink5URL: https://datasheet.ciiva.com/332/sp05xxba-332551.pdf?src-supplier=Digi-Key; ComponentLink5Description: https://datasheet.ciiva.com/332/sp05xxba-332551.pdf?src-supplier=Digi-Key; ComponentLink6URL: https://datasheet.ciiva.com/16449/sp05xxba-16449463.pdf?src-supplier=Future+Electronics; ComponentLink6Description: https://datasheet.ciiva.com/16449/sp05xxba-16449463.pdf?src-supplier=Future+Electronics; ComponentLink7URL: https://datasheet.ciiva.com/332/sp05xxba-332552.pdf?src-supplier=Digi-Key; ComponentLink7Description: https://datasheet.ciiva.com/332/sp05xxba-332552.pdf?src-supplier=Digi-Key; ComponentLink8URL: https://datasheet.ciiva.com/4509/sp05x-leadfree-4509162.pdf?src-supplier=Mouser; ComponentLink8Description: https://datasheet.ciiva.com/4509/sp05x-leadfree-4509162.pdf?src-supplier=Mouser; ComponentLink9URL: https://datasheet.ciiva.com/7650/526672-7650894.pdf?src-supplier=Element14; ComponentLink9Description: https://datasheet.ciiva.com/7650/526672-7650894.pdf?src-supplier=Element14; Supplier Part Number 1: F2715CT-ND
esp = ESP_32_lolin
Jumper1-Jumper6 = 0805Jumper
R1-R15 R17 R18 = resistor(CRCW0805360RFKEA: Res Thick Film 0805 360 Ohm 1% 0.125W(1/8W) ±100ppm/C Molded SMD Automotive Paper T/R; Manufacturer 1: Vishay; Resistance: 360R; Temperature Coefficient: 100ppm/°C; Max Power Dissipation: 125mW; Voltage Rating (DC): 150V; Supplier 1: Digi-Key; Manufacturer Part Number 1: CRCW0805360RFKEA; RoHS: Yes; Category: Chip SMD Resistors; Stock 1: 25005; Pricing 1: 1=0.10000, 10=0.06000, 100=0.02450, 1000=0.01102, 2500=0.00957 (USD); Case/Package: 0805; Number of Pins: 2; Weight: 0.000194oz; Case Code (Metric): 2012; Case Code (Imperial): 0805; Contact Plating: Tin; Number of Terminals: 2; Min Operating Temperature: -55°C; Max Operating Temperature: 155°C; Tolerance: 1%; Packaging: Tape and Reel; Composition: Thick Film; Package Quantity: 10; Number of Terminations: 2; Features: Automotive AEC-Q200; Power Rating: 125mW; Voltage Rating: 150V; Termination: SMD/SMT; Military Standard: Not; Length: 2mm; Height: 0.45mm; Width: 0.049inch; Depth: 1.25mm; Radiation Hardening: No; Lead Free: Lead Free; REACH SVHC: Unknown; ComponentLink1URL: https://datasheet.ciiva.com/2467/dcrcwe3-2467773.pdf?src-supplier=Digi-Key; ComponentLink1Description: https://datasheet.ciiva.com/2467/dcrcwe3-2467773.pdf?src-supplier=Digi-Key; Supplier Part Number 1: 541-360CCT-ND
R16 R21 R22 = CRCW0805360RFKEA: Res Thick Film 0805 360 Ohm 1% 0.125W(1/8W) ±100ppm/C Molded SMD Automotive Paper T/R; Manufacturer 1: Vishay; Resistance: 360R; Temperature Coefficient: 100ppm/°C; Max Power Dissipation: 125mW; Voltage Rating (DC): 150V; Supplier 1: Digi-Key; Manufacturer Part Number 1: CRCW0805360RFKEA; RoHS: Yes; Category: Chip SMD Resistors; Stock 1: 25005; Pricing 1: 1=0.10000, 10=0.06000, 100=0.02450, 1000=0.01102, 2500=0.00957 (USD); Case/Package: 0805; Number of Pins: 2; Weight: 0.000194oz; Case Code (Metric): 2012; Case Code (Imperial): 0805; Contact Plating: Tin; Number of Terminals: 2; Min Operating Temperature: -55°C; Max Operating Temperature: 155°C; Tolerance: 1%; Packaging: Tape and Reel; Composition: Thick Film; Package Quantity: 10; Number of Terminations: 2; Features: Automotive AEC-Q200; Power Rating: 125mW; Voltage Rating: 150V; Termination: SMD/SMT; Military Standard: Not; Length: 2mm; Height: 0.45mm; Width: 0.049inch; Depth: 1.25mm; Radiation Hardening: No; Lead Free: Lead Free; REACH SVHC: Unknown; ComponentLink1URL: https://datasheet.ciiva.com/2467/dcrcwe3-2467773.pdf?src-supplier=Digi-Key; ComponentLink1Description: https://datasheet.ciiva.com/2467/dcrcwe3-2467773.pdf?src-supplier=Digi-Key; Supplier Part Number 1: 541-360CCT-ND
R19 = resistor(CRCW0805360RFKEA: 1Kohms; Manufacturer 1: Vishay; Resistance: 360R; Tolerance: 1%; Temperature Coefficient: 100ppm/°C; Max Power Dissipation: 125mW; Voltage Rating (DC): 150V; Supplier 1: Digi-Key; Manufacturer Part Number 1: CRCW0805360RFKEA; RoHS: Yes; Category: Chip SMD Resistors; Stock 1: 25005; Pricing 1: 1=0.10000, 10=0.06000, 100=0.02450, 1000=0.01102, 2500=0.00957 (USD); Case/Package: 0805; Number of Pins: 2; Weight: 0.000194oz; Case Code (Metric): 2012; Case Code (Imperial): 0805; Contact Plating: Tin; Number of Terminals: 2; Min Operating Temperature: -55°C; Max Operating Temperature: 155°C; Packaging: Tape and Reel; Composition: Thick Film; Package Quantity: 10; Number of Terminations: 2; Features: Automotive AEC-Q200; Power Rating: 125mW; Voltage Rating: 150V; Termination: SMD/SMT; Military Standard: Not; Length: 2mm; Height: 0.45mm; Width: 0.049inch; Depth: 1.25mm; Radiation Hardening: No; Lead Free: Lead Free; REACH SVHC: Unknown; ComponentLink1URL: https://datasheet.ciiva.com/2467/dcrcwe3-2467773.pdf?src-supplier=Digi-Key; ComponentLink1Description: https://datasheet.ciiva.com/2467/dcrcwe3-2467773.pdf?src-supplier=Digi-Key; Supplier Part Number 1: 541-360CCT-ND
R20 = CRCW0805360RFKEA: Res Thick Film 0805 360 Ohm 1% 0.125W(1/8W) ±100ppm/C Molded SMD Automotive Paper T/R; Manufacturer 1: Vishay; Temperature Coefficient: 100ppm/°C; Max Power Dissipation: 125mW; Voltage Rating (DC): 150V; Supplier 1: Digi-Key; Manufacturer Part Number 1: CRCW0805360RFKEA; RoHS: Yes; Category: Chip SMD Resistors; Stock 1: 25005; Pricing 1: 1=0.10000, 10=0.06000, 100=0.02450, 1000=0.01102, 2500=0.00957 (USD); Case/Package: 0805; Number of Pins: 2; Weight: 0.000194oz; Case Code (Metric): 2012; Case Code (Imperial): 0805; Contact Plating: Tin; Number of Terminals: 2; Min Operating Temperature: -55°C; Max Operating Temperature: 155°C; Resistance: 360R; Tolerance: 1%; Packaging: Tape and Reel; Composition: Thick Film; Package Quantity: 10; Number of Terminations: 2; Features: Automotive AEC-Q200; Power Rating: 125mW; Voltage Rating: 150V; Termination: SMD/SMT; Military Standard: Not; Length: 2mm; Height: 0.45mm; Width: 0.049inch; Depth: 1.25mm; Radiation Hardening: No; Lead Free: Lead Free; REACH SVHC: Unknown; ComponentLink1URL: https://datasheet.ciiva.com/2467/dcrcwe3-2467773.pdf?src-supplier=Digi-Key; ComponentLink1Description: https://datasheet.ciiva.com/2467/dcrcwe3-2467773.pdf?src-supplier=Digi-Key; Supplier Part Number 1: 541-360CCT-ND
usb1 = usb_A_horizontal: 4 Position Single Port Socket Right Angle Type A Through Hole USB; Manufacturer 1: TE Connectivity; Manufacturer Part Number 1: 292303-1; Plating: Bright,Tin; Current Rating: 1A; Voltage Rating (AC): 30V; Gender: Receptacle; Number of Ports: 1; Insulation Resistance: 1GR; Number of Contacts: 4; Plating Thickness: 0.76um; USB Standard: USB 2.0; Circuit Application: Signal; Connector System: Cable-to-Board; PCB Thickness: 0.062inch; Tail Length: 0.112inch; Pitch: 2.5mm; Approvals: UL; Supplier 1: Digi-Key; RoHS: Yes; Category: Audio / Video Connectors; Stock 1: 16277; Pricing 1: 1=1.49000, 10=1.35400, 25=1.27160, 50=1.21620, 100=1.16100, 250=1.05040, 500=0.96748, 1000=0.82926, 2500=0.77398 (USD); Mount: Through Hole,Horizontal; Contact Plating: Gold; Contact Material: Copper Alloy,Copper; Color: Black; Number of Terminals: 4; Housing Material: Thermoplastic; Housing Color: Black; Min Operating Temperature: -67°C; Max Operating Temperature: 185°C; Packaging: Rail/Tube; Package Quantity: 30; Connector Type: Receptacle; Termination: Through Hole; Number of Positions: 4; Orientation: Right Angle; Contact Current Rating: 1A; Length: 14.63mm; Depth: 14mm; REACH SVHC: No SVHC; Flammability Rating: UL94 V-0; Halogen Free: Halogen Free; ComponentLink1URL: https://datasheet.ciiva.com/851/eng-cd-292303-e9-851601.pdf?src-supplier=Farnell; ComponentLink1Description: https://datasheet.ciiva.com/851/eng-cd-292303-e9-851601.pdf?src-supplier=Farnell; ComponentLink2URL: https://datasheet.ciiva.com/1099/1653030-1099765.pdf?src-supplier=Newark; ComponentLink2Description: https://datasheet.ciiva.com/1099/1653030-1099765.pdf?src-supplier=Newark; ComponentLink3URL: https://datasheet.ciiva.com/1098/eng-cd-292303-e9-1098298.pdf?src-supplier=Element14; ComponentLink3Description: https://datasheet.ciiva.com/1098/eng-cd-292303-e9-1098298.pdf?src-supplier=Element14; ComponentLink4URL: https://datasheet.ciiva.com/11731/0900766b806d08c4-11731322.pdf?src-supplier=RSComponents; ComponentLink4Description: https://datasheet.ciiva.com/11731/0900766b806d08c4-11731322.pdf?src-supplier=RSComponents; ComponentLink5URL: https://datasheet.ciiva.com/14103/04270708-14103420.pdf?src-supplier=Distrelec; ComponentLink5Description: https://datasheet.ciiva.com/14103/04270708-14103420.pdf?src-supplier=Distrelec; ComponentLink6URL: https://datasheet.ciiva.com/19454/921651-19454494.pdf?src-supplier=Jameco; ComponentLink6Description: https://datasheet.ciiva.com/19454/921651-19454494.pdf?src-supplier=Jameco; ComponentLink7URL: https://datasheet.ciiva.com/16308/eng-cd-292303-e7-16308319.pdf?src-supplier=Future+Electronics; ComponentLink7Description: https://datasheet.ciiva.com/16308/eng-cd-292303-e7-16308319.pdf?src-supplier=Future+Electronics; ComponentLink8URL: https://datasheet.ciiva.com/3094/eng-ds-1-1773453-6-0908-3094357.pdf?src-supplier=Avnet; ComponentLink8Description: https://datasheet.ciiva.com/3094/eng-ds-1-1773453-6-0908-3094357.pdf?src-supplier=Avnet; ComponentLink9URL: https://datasheet.ciiva.com/16468/eng-ds-1-1773453-6-0908-16468232.pdf?src-supplier=Avnet+Asia; ComponentLink9Description: https://datasheet.ciiva.com/16468/eng-ds-1-1773453-6-0908-16468232.pdf?src-supplier=Avnet+Asia; ComponentLink10URL: https://datasheet.ciiva.com/851/eng-cd-292303-e9-851082.pdf?src-supplier=Digi-Key; ComponentLink10Description: https://datasheet.ciiva.com/851/eng-cd-292303-e9-851082.pdf?src-supplier=Digi-Key; ComponentLink11URL: https://datasheet.ciiva.com/8016/1653030-8016986.pdf?src-supplier=Element14; ComponentLink11Description: https://datasheet.ciiva.com/8016/1653030-8016986.pdf?src-supplier=Element14; ComponentLink12URL: https://datasheet.ciiva.com/14618/70041246-14618698.pdf?src-supplier=Allied+Electronics; ComponentLink12Description: https://datasheet.ciiva.com/14618/70041246-14618698.pdf?src-supplier=Allied+Electronics; ComponentLink13URL: https://datasheet.ciiva.com/25907/eng-ds-1-1773453-6-0908-25907515.pdf?src-supplier=Avnet+Europe; ComponentLink13Description: https://datasheet.ciiva.com/25907/eng-ds-1-1773453-6-0908-25907515.pdf?src-supplier=Avnet+Europe; ComponentLink14URL: https://datasheet.ciiva.com/30148/ddecontrolleractionsrchrtrvdocnm117734536doctypedsdoclan-30148862.pdf?src-supplier=Onlinecomponents.com; ComponentLink14Description: https://datasheet.ciiva.com/30148/ddecontrolleractionsrchrtrvdocnm117734536doctypedsdoclan-30148862.pdf?src-supplier=Onlinecomponents.com; Supplier Part Number 1: A31726-ND
F1-F4 = PTC_0ZCG0260FF2C: ComponentLink1Description: Digikey; ComponentLink1URL: https://www.digikey.tw/product-detail/zh/bel-fuse-inc/0ZCG0260FF2C/507-1778-1-ND/4156282
Relay1 = Omron_G5v_dc5: ComponentLink1Description: datasheed_be_aware of pin; ComponentLink1URL: https://omronfs.omron.com/en_US/ecb/products/pdf/en-g5v_1.pdf